# EAGLE design wheel-speed-tester-rev2 (EAGLE 9.6.2)
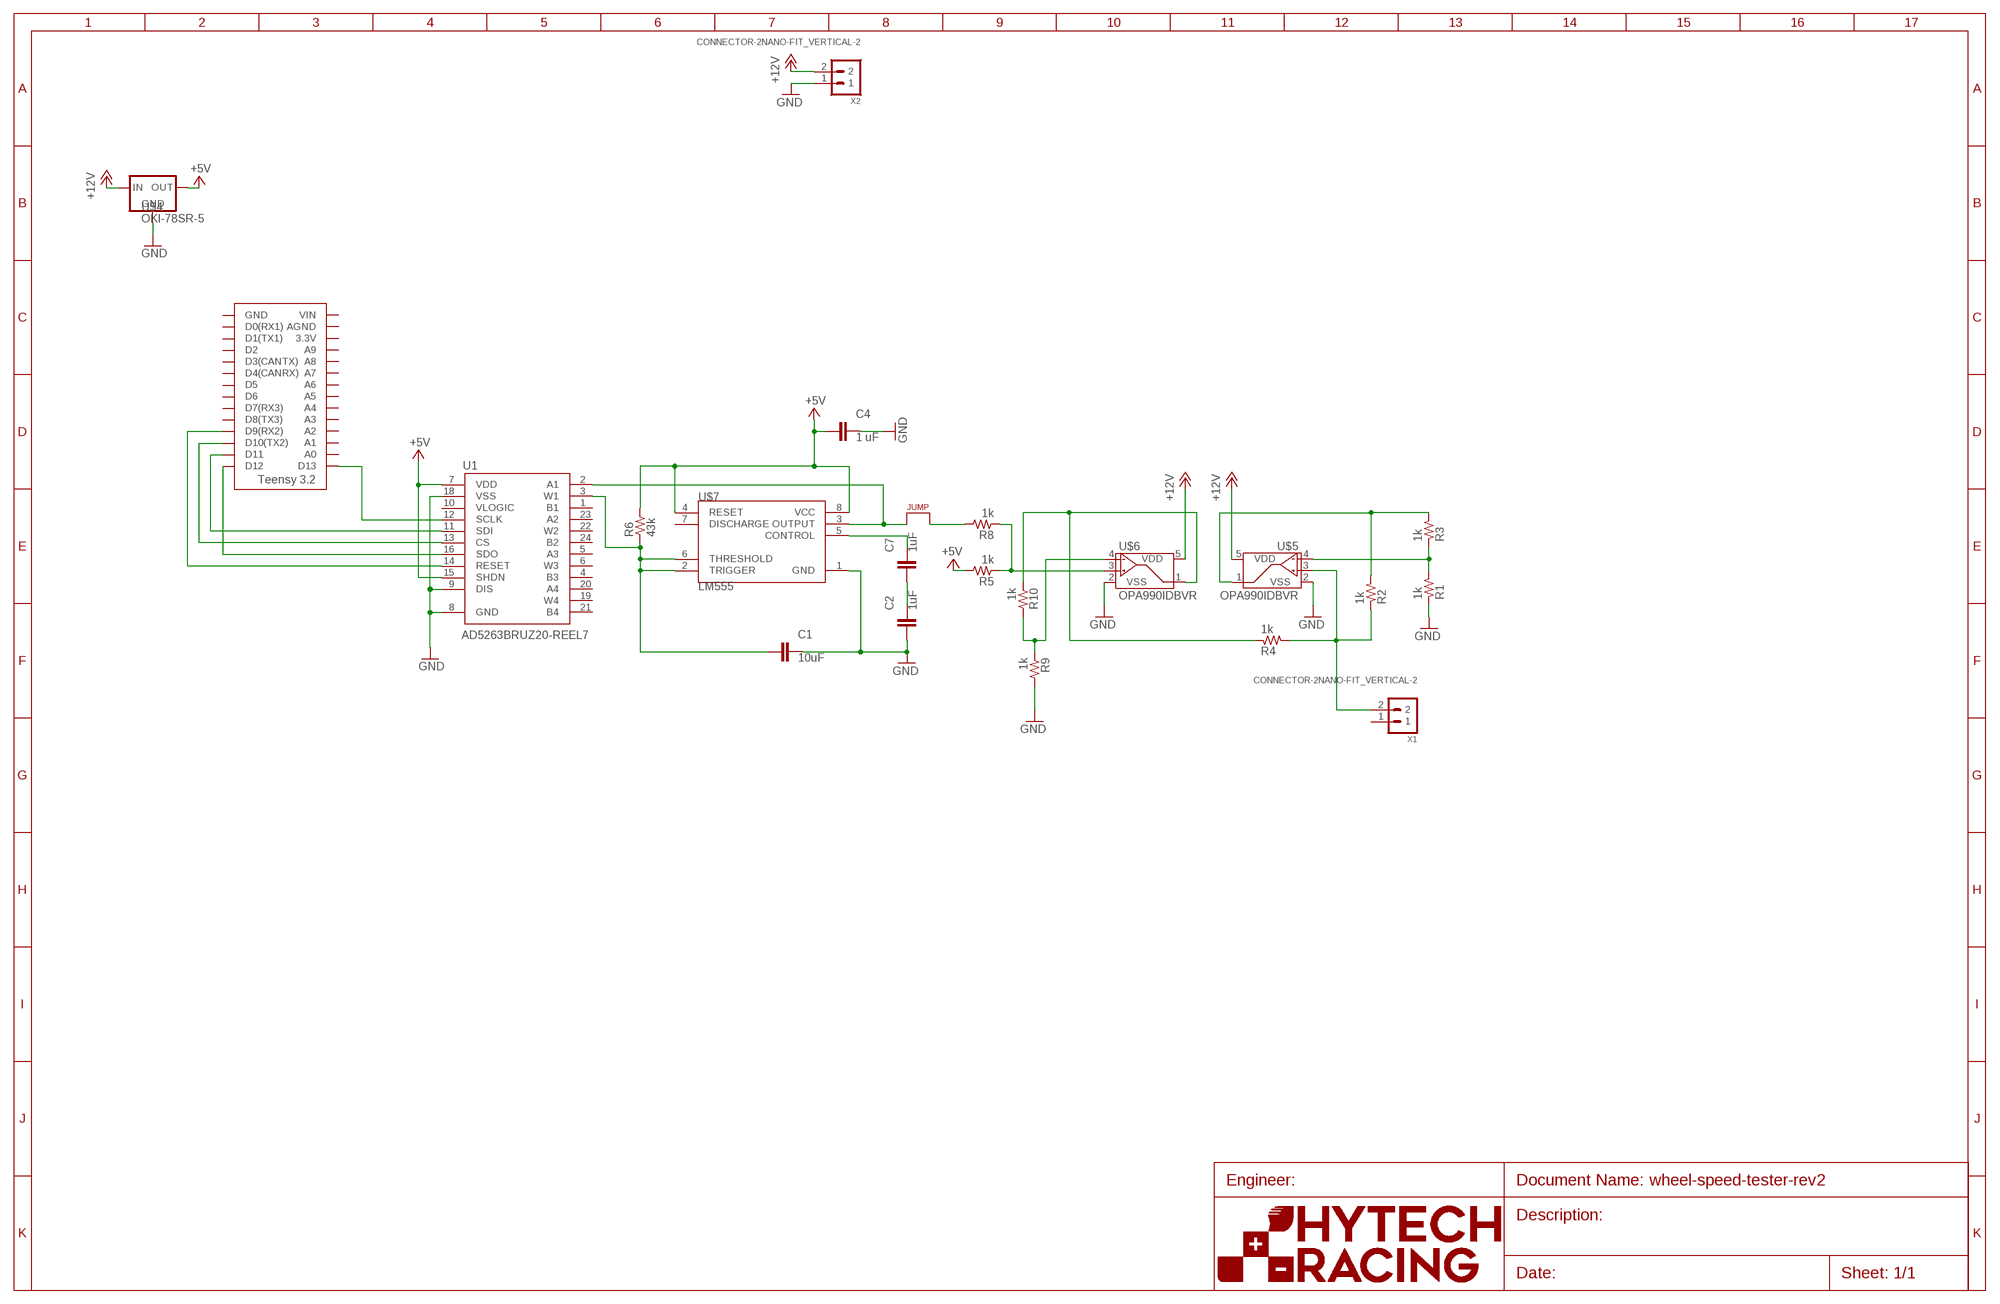
[diagram p0: schematic, sheet 1]
U$1 (FRAME_B): FRAME_DESCRIPTION: Default; ORIENTATION: LANDSCAPE; SIZE: B

## Parts
C1  10uF  CAP0603-CAP  [0603-CAP]
C2  1uF  CAP0603-CAP  [0603-CAP]
C4  1 uF  CAP0603-CAP  [0603-CAP]
C7  1uF  CAP0603-CAP  [0603-CAP]
J2  JUMPER.1  [1X02]
R1  1k  RESISTOR0603  [0603-RES]
R2  1k  RESISTOR0603  [0603-RES]
R3  1k  RESISTOR0603  [0603-RES]
R4  1k  RESISTOR0603  [0603-RES]
R5  1k  RESISTOR0603  [0603-RES]
R6  43k  RESISTOR0603  [0603-RES]
R8  1k  RESISTOR0603  [0603-RES]
R9  1k  RESISTOR0603  [0603-RES]
R10  1k  RESISTOR0603  [0603-RES]
U1  AD5263BRUZ20-REEL7  [TSSOP-24]
U$2  TEENSY_3.2_SIMPLE  [TEENSY_3.2_SIMPLE]
U$4  OKI-78SR-5  [OKI-78SR]
U$5  OPA990IDBVR  [SOT-23-5]
U$6  OPA990IDBVR  [SOT-23-5]
U$7  LM555  [SOIC-08]
X1  CONNECTOR-2NANO-FIT_VERTICAL-2  [1053091202]
X2  CONNECTOR-2NANO-FIT_VERTICAL-2  [1053091202]

## Nets
+5V: C4.2 R5.2 R6.2 U1.7(VDD) U1.15(SHDN) U$4.3(OUT) U$7.4(RESET) U$7.8(VCC)
+12V: U$4.1(IN) U$5.5(VDD) U$6.5(VDD) X2.2
ALTERNATINGVOLTAGE: R4.1 R10.1 U$6.1(VOUT)
CS: U1.13(CS) U$2.D10(TX2)
GND: C1.1 C2.2 C4.1 R1.1 R9.2 U1.8(GND) U1.9(DIS) U1.18(VSS) U$4.2(GND) U$5.2(VSS) U$6.2(VSS) U$7.1(GND) X2.1
N$1: R2.2 R3.2 U$5.1(VOUT)
N$2: R1.2 R3.1 U$5.4(VIN-)
N$3: C7.1 U$7.5(CONTROL)
N$4: J2.2 R8.2
N$6: R5.1 R8.1 U$6.3(VIN+)
N$7: C2.1 C7.2
N$8: J2.1 U1.2(A1) U$7.3(OUTPUT)
N$9: R9.1 R10.2 U$6.4(VIN-)
N$10: U1.11(SDI) U$2.D11
N$11: U1.16(SDO) U$2.D12
N$17: C1.2 R6.1 U1.3(W1) U$7.2(TRIGGER) U$7.6(THRESHOLD)
RESET: U1.14(RESET) U$2.D9(RX2)
SCLK: U1.12(SCLK) U$2.D13
WSTESTER_OUT: R2.1 R4.2 U$5.3(VIN+) X1.2
Unconnected: U1.1(B1) U1.4(B3) U1.5(A3) U1.6(W3) U1.10(VLOGIC) U1.19(W4) U1.20(A4) U1.21(B4) U1.22(W2) U1.23(A2) U1.24(B2) U$2.3.3V U$2.A0 U$2.A1 U$2.A2 U$2.A3 U$2.A4 U$2.A5 U$2.A6 U$2.A7 U$2.A8 U$2.A9 U$2.AGND U$2.D0(RX1) U$2.D1(TX1) U$2.D2 U$2.D3(CANTX) U$2.D4(CANRX) U$2.D5 U$2.D6 U$2.D7(RX3) U$2.D8(TX3) U$2.GND U$2.VIN U$7.7(DISCHARGE) X1.1

## Library data of the parts
C1 C2 C4 C7 = HyTechDevices:CAP: Capacitor Standard 0603 ceramic capacitor, and 0.1" leaded capacitor.
J2 = HyTechDevices:JUMPER: Jumper for changing operation of a device
R1-R6 R8-R10 = HyTechDevices:RESISTOR: Resistor Basic schematic elements and footprints for 0603, 1206, and PTH resistors.
U1 = HyTechDevices:AD5263BRUZ20-REEL7: AD5263 20 kΩ Digital Potentiometer Datasheet <https://www.mouser.com/datasheet/2/609/AD5263-1501493.pdf>; DKPN: AD5263BRUZ20-REEL7CT-ND; MOPN: 584-AD5263BRUZ20-R7; RESISTANCE: 20kΩ; TOLERANCE: 30%
U$2 = HyTechDevices:TEENSY_3.2_SIMPLE: Simple version of the Teensy 3.2 board that only uses the 2 main rows of pins, not the inner pins or the pins opposite the usb port.
U$4 = HyTechDevices:OKI-78SR-5: Murata OKI-78SR 5V 1.5A Non-Isolated Switching Regulator DC/DC - Datasheet <https://power.murata.com/data/power/oki-78sr.pdf>
U$5 U$6 = HyTechDevices:OPA990IDBVR: TI OPA990 20V Op-Amp Comparator Datasheet <https://www.ti.com/lit/ds/symlink/opa990.pdf>
U$7 = HyTechDevices:LM555: Texas Instruments NA555 timer. Data sheet <http://www.ti.com/lit/ds/symlink/se555.pdf>
X1 X2 = HyTechDevices:CONNECTOR-2: Mini-Fit Junior connector 2 pole Source: http://www.molex.com

## Board
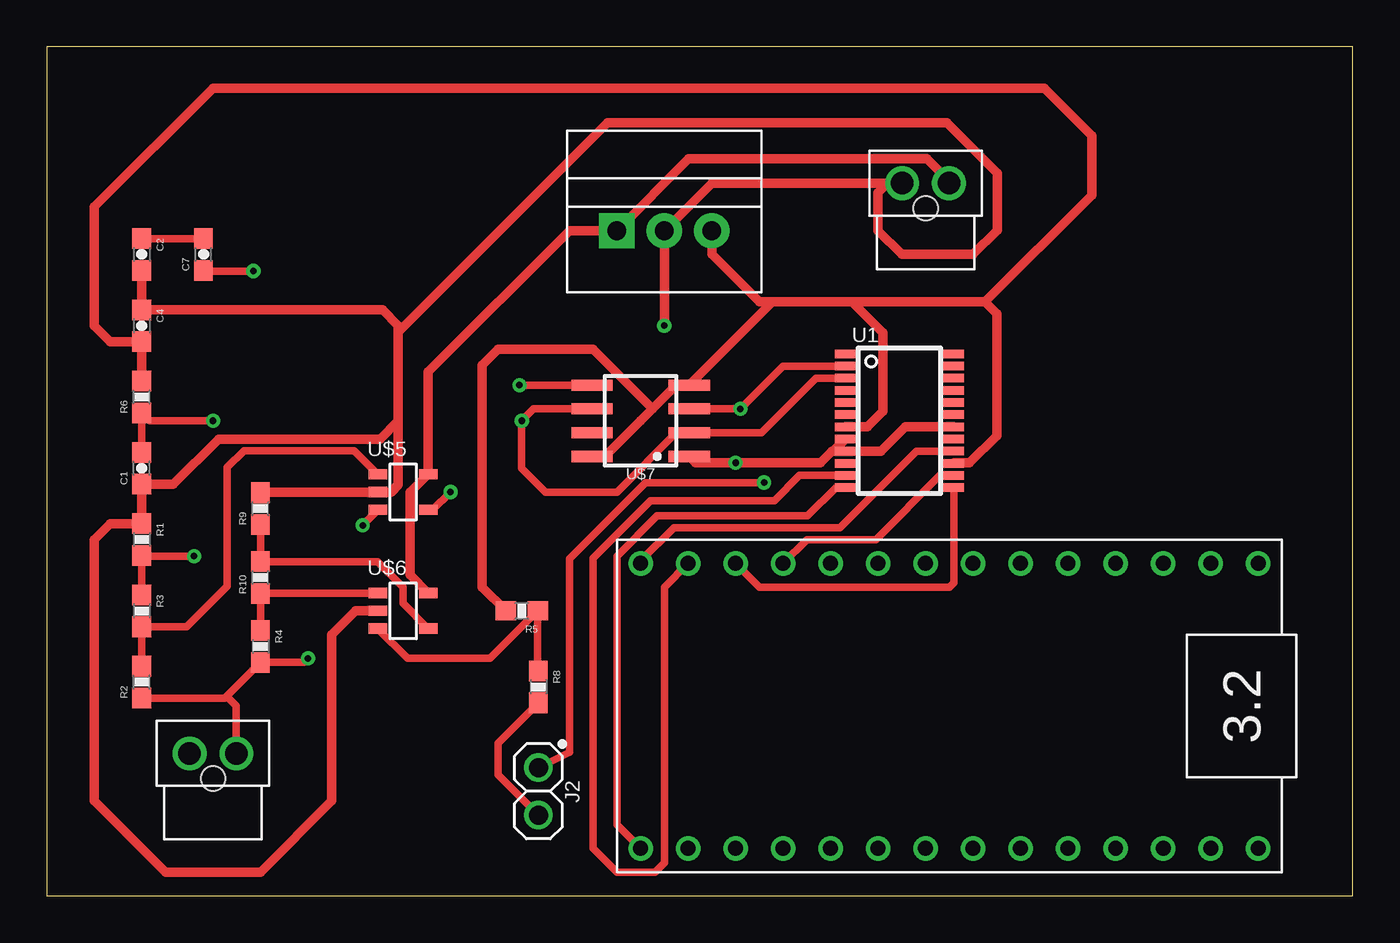
[diagram p1: board, top side]
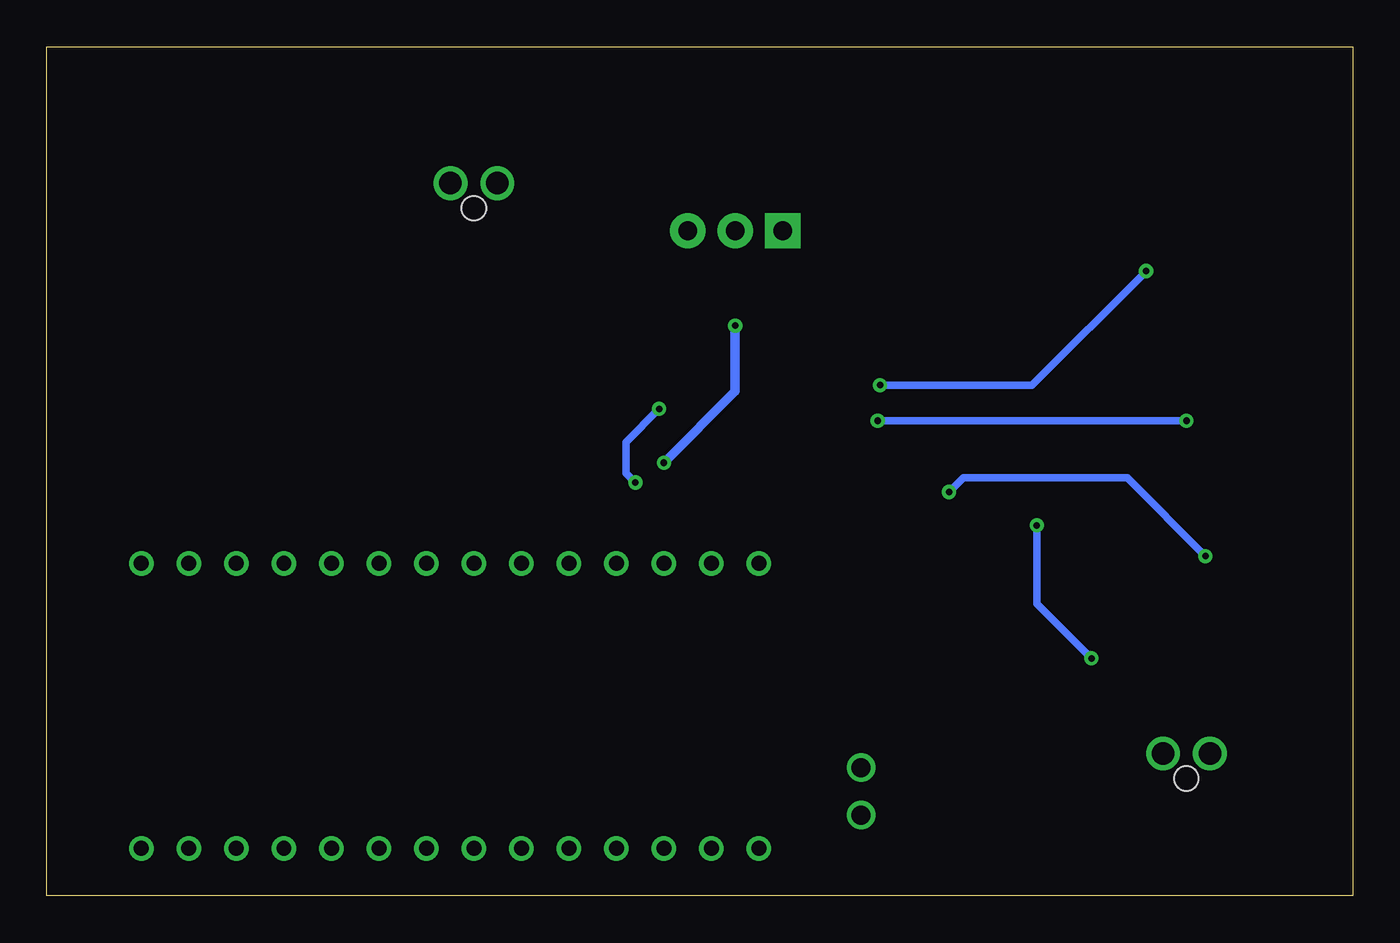
[diagram p2: board, bottom side, seen from below]

Size 69.83 x 45.39 mm. Coordinates in mm from the lower left corner, seen from the top.
Outline: 0,0 69.83,0 69.83,45.39 0,45.39 0,0
Copper layers (1*16): Top 0.035mm / dielectric 1.5mm / Bottom 0.035mm
Design rules "default": minimum track width 6mil, minimum drill 0.35mm, track to track 6mil, track to pad 6mil, pad to pad 6mil, via to via 6mil, smd to smd 6mil, copper to edge 40mil, drill to drill 6mil, minimum pad ring 10mil, minimum via ring 8mil, stop-mask expansion 4mil, vias tented up to drill 0mil, thermal gap 10mil

### Footprints (pad centres in the part's own frame; a part is rotated, then mirrored left to right if it is on the bottom)
0603-CAP = smd 1.1 x 1: 1 -0.85,0; 2 0.85,0
1X02 = drill 1.016: 1 -1.27,0; 2 1.27,0
0603-RES = smd 1.1 x 1: 1 -0.85,0; 2 0.85,0
TSSOP-24 = smd 1.1 x 0.45: 1 -2.9,3.575; 2 -2.9,2.925; 3 -2.9,2.275; 4 -2.9,1.625; 5 -2.9,0.975; 6 -2.9,0.325; 7 -2.9,-0.325; 8 -2.9,-0.975; 9 -2.9,-1.625; 10 -2.9,-2.275; 11 -2.9,-2.925; 12 -2.9,-3.575; 13 2.9,-3.575; 14 2.9,-2.925; 15 2.9,-2.275; 16 2.9,-1.625; 17 2.9,-0.975; 18 2.9,-0.325; 19 2.9,0.325; 20 2.9,0.975; 21 2.9,1.625; 22 2.9,2.275; 23 2.9,2.925; 24 2.9,3.575
TEENSY_3.2_SIMPLE = drill 0.8: 3.3V 16.51,29.21; A0 16.51,3.81; A1 16.51,6.35; A2 16.51,8.89; A3 16.51,11.43; A4 16.51,13.97; A5 16.51,16.51; A6 16.51,19.05; A7 16.51,21.59; A8 16.51,24.13; A9 16.51,26.67; AGND 16.51,31.75; D0(RX1) 1.27,31.75; D1(TX1) 1.27,29.21; D2 1.27,26.67; D3(CANTX) 1.27,24.13; D4(CANRX) 1.27,21.59; D5 1.27,19.05; D6 1.27,16.51; D7(RX3) 1.27,13.97; D8(TX3) 1.27,11.43; D9(RX2) 1.27,8.89; D10(TX2) 1.27,6.35; D11 1.27,3.81; D12 1.27,1.27; D13 16.51,1.27; GND 1.27,34.29; VIN 16.51,34.29
OKI-78SR = drill 1 pad 1.88 square: 1 -2.54,0 | drill 1 pad 1.88: 2 0,0; 3 2.54,0
SOT-23-5 = smd 1 x 0.55: 1 -1.35,0.95; 2 -1.35,0; 3 -1.35,-0.95; 4 1.35,-0.95; 5 1.35,0.95
SOIC-08 = smd 0.6 x 2.2: 1 -1.905,-2.6; 2 -0.635,-2.6; 3 0.635,-2.6; 4 1.905,-2.6; 5 1.905,2.6; 6 0.635,2.6; 7 -0.635,2.6; 8 -1.905,2.6
1053091202 = drill 1.2: 1 -1.25,0; 2 1.25,0 | hole 1.3: 0,-1.34

### Placement (x,y rotation side)
C1  5.08,22.86 90 top
C2  5.08,34.29 270 top
C4  5.08,30.48 270 top
C7  8.38,34.29 90 top
J2  26.29,5.59 270 top
R1  5.08,19.05 270 top
R2  5.08,11.43 90 top
R3  5.08,15.24 270 top
R4  11.43,13.34 270 top
R5  25.4,15.24 180 top
R6  5.08,26.67 90 top
R8  26.29,11.18 270 top
R9  11.43,20.7 90 top
R10  11.43,17.02 90 top
U1  45.59,25.4 0 top
U$2  30.48,19.05 270 top
U$4  33.02,35.56 0 top
U$5  19.05,21.59 0 top
U$6  19.05,15.24 0 top
U$7  31.75,25.4 90 top
X1  8.89,7.62 0 top
X2  46.99,38.1 0 top

### Tracks (layer width: path | path; a pad name or v marks a point on that pad's centre or on a via)
+5V
  Top 0.508: 50.16,31.75 43.05,31.75 | 43.05,31.75 38.8,31.75 | 38.8,31.75 38.1,31.75 35.56,34.29 U$4.3 | 43.05,31.75 44.7,30.1 44.7,25.91 43.87,25.07 U1.7 | 38.8,31.75 U$7.4 33.65,27.3 32.38,26.04 | U$7.8 29.86,23.5 31.75,25.39 31.75,25.41 32.38,26.04 | R6.2 C4.2 3.39,29.63 2.54,30.48 2.54,36.83 8.89,43.18 53.34,43.18 55.88,40.64 55.88,37.47 50.16,31.75 | R5.2 23.28,16.51 23.28,28.36 24.13,29.21 29.22,29.21 32.38,26.05 32.38,26.04 | U1.15 48.51,23.14 49.34,23.14 50.8,24.61 50.8,31.11 50.16,31.75
+12V
  Top 0.406: X2.2 48.3,38.16
  Top 0.508: U$6.5 19.43,17.16 19.43,21.57 U$5.5 20.4,28.02 27.94,35.56 U$4.1 34.33,39.41 47.06,39.41 48.3,38.16
ALTERNATINGVOLTAGE
  Top 0.406: U$6.1 11.45,16.19 R10.1 R4.1
CS
  Top 0.406: U1.13 48.49,16.74 48.26,16.51 38.1,16.51 U$2.D10(TX2)
GND  (via drill 0.35)
  Top 0.508: X2.1 44.96,38.1 | 44.96,38.1 35.56,38.1 U$4.2 v33.02,30.48 | U$7.1 34.69,23.16 v36.83,23.16 41.37,23.16 41.99,23.77 42.04,23.77 | U$5.2 17.66,21.55 | 18.8,25.4 18.8,21.97 18.41,21.59 U$5.2 | 18.8,25.4 18.8,30.14 | 18.8,30.14 18.8,30.48 17.95,31.33 C4.1 C2.2 | 18.8,30.14 29.99,41.34 48.12,41.34 50.82,38.64 50.82,35.58 49.53,34.29 45.72,34.29 44.45,35.56 44.45,37.59 44.96,38.1 | R9.2 11.47,21.59 U$5.2 | 18.8,25.4 17.82,24.42 9.18,24.42 6.77,22.01 C1.1 R1.1 3.39,19.9 2.54,19.05 2.54,5.08 6.35,1.27 11.43,1.27 15.24,5.08 15.24,13.97 16.51,15.24 U$6.2 | U1.18 45.9,25.07 44.6,23.77 U1.9 42.04,23.77 | U1.8 42.04,23.77
  Bottom 0.508: v36.83,23.16 33.02,26.96 v33.02,30.48
N$1
  Top 0.406: U$5.1 16.43,23.81 10.54,23.81 9.65,22.92 9.65,16.55 7.49,14.39 R3.2 R2.2
N$2  (via drill 0.35)
  Top 0.406: R3.1 R1.2 5.12,18.16 v7.87,18.16 | U$5.4 20.64,20.64 v21.59,21.59
  Bottom 0.406: v21.59,21.59 20.83,22.35 12.06,22.35 v7.87,18.16
N$3  (via drill 0.35)
  Top 0.406: U$7.5 v25.27,27.3 | v11.05,33.4 8.42,33.4 C7.1
  Bottom 0.406: v25.27,27.3 17.14,27.3 v11.05,33.4
N$4
  Top 0.406: R8.2 24.13,8.17 24.13,6.48 J2.2
N$6
  Top 0.406: U$6.3 19.29,12.7 23.71,12.7 R5.1 26.25,12.06 R8.1
N$7
  Top 0.406: C2.1 C7.2
N$8  (via drill 0.35)
  Top 0.406: U1.2 39.37,28.32 v37.08,26.04 U$7.3 | J2.1 27.94,7.68 27.94,18.03 32,22.1 v38.35,22.1
  Bottom 0.406: v37.08,26.04 38.86,24.26 38.86,22.61 v38.35,22.1
N$9
  Top 0.406: R9.1 R10.2 17.69,17.87 19.05,16.51 19.05,15.64 U$6.4
N$10
  Top 0.406: U1.11 40.26,22.48 38.91,21.13 32.28,21.13 29.21,18.06 29.21,2.54 30.48,1.27 32.51,1.27 33.02,1.78 33.02,16.51 U$2.D11
N$11
  Top 0.406: U1.16 48.26,23.77 47.78,23.77 46.51,23.77 42.42,19.68 33.53,19.68 31.75,17.91 U$2.D12
N$17  (via drill 0.35)
  Top 0.406: U1.3 41.14,27.68 38.23,24.77 U$7.2 33.66,24.77 30.48,21.59 26.67,21.59 25.4,22.86 v25.4,25.4 26.04,26.04 U$7.6 | C1.2 R6.1 5.5,25.4 v8.89,25.4
  Bottom 0.406: v8.89,25.4 v25.4,25.4
RESET
  Top 0.406: U1.14 47.75,22.48 44.32,19.05 40.64,19.05 U$2.D9(RX2)
SCLK
  Top 0.406: U1.12 42.19,21.82 40.68,20.32 32.64,20.32 30.48,18.16 30.48,3.81 U$2.D13
WSTESTER_OUT  (via drill 0.35)
  Top 0.406: 9.63,10.69 R4.2 13.76,12.48 v13.97,12.7 | 9.63,10.69 9.53,10.58 R2.1 | 16.89,19.83 v16.89,19.81 17.7,20.62 U$5.3 | 9.63,10.69 10.14,10.18 X1.2
  Bottom 0.406: v16.89,19.81 16.89,15.62 v13.97,12.7